# EAGLE design SecUSB (EAGLE 7.1.0)
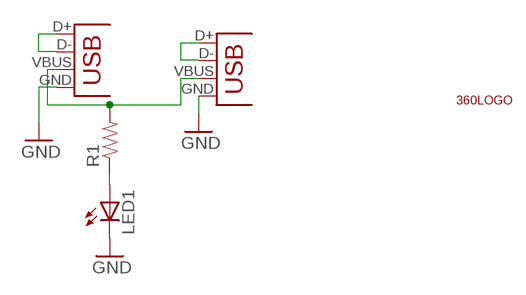
[diagram p0: schematic, sheet 1]

## Parts
LED1  LED0603  [LED-0603]
R1  RESISTOR0603-RES  [0603-RES]
U$1  360LOGO_0.8  [360LOGO_0.8]
X2  USB_4-A-H_2  [USB-A-H_2]
X3  USB_4_3  [USB-A-3]

## Nets
GND: LED1.C X2.GND X3.GND
N$1: R1.2 X2.VBUS X3.VBUS
N$2: X2.D+ X2.D-
N$3: X3.D+ X3.D-
N$4: LED1.A R1.1

## Library data of the parts
LED1 = 2SparkFun:LED: LEDs Standard schematic elements and footprints for 5mm, 3mm, 1206, and 0603 sized LEDs. 5mm - Spark Fun Electronics SKU : COM-00529 (and others)
R1 = 2SparkFun:RESISTOR: Resistor Basic schematic elements and footprints for 0603, 1206, and PTH resistors.
U$1 = 2SparkFun:360LOGO
X2 X3 = 2SparkFun:USB_4: USB Connectors USB-B-PTH is fully proven SKU : PRT-00139 USB-miniB is fully proven SKU : PRT-00587 USB-A-PCB is untested. USB-A-H is throughly reviewed, but untested. Spark Fun Electronics SKU : PRT-00437 USB-B-SMT is throughly reviewed, but untested. Needs silkscreen touching up. USB-A-S has not been used/tested USB-MB-H has not been used/tested

## Board
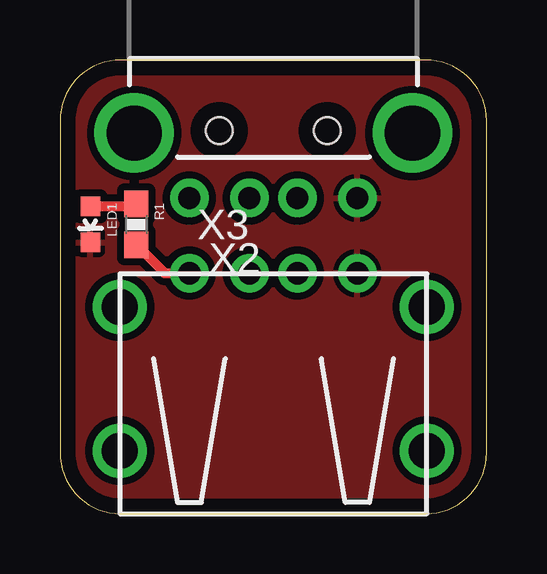
[diagram p1: board, top side]
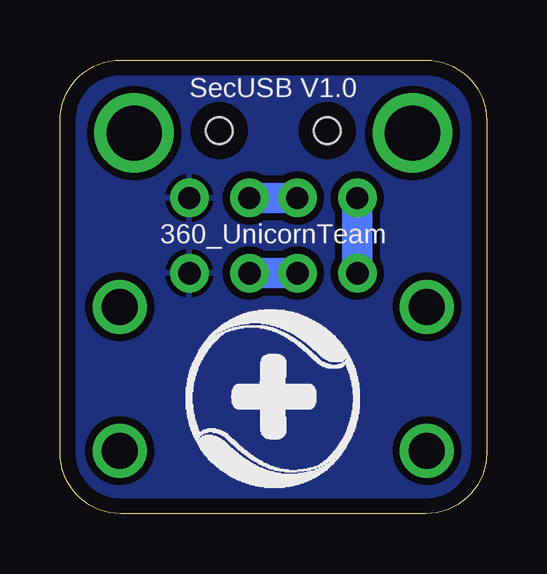
[diagram p2: board, bottom side, seen from below]

Size 17.78 x 18.92 mm. Coordinates in mm from the lower left corner, seen from the top.
Outline: 0,16.38 0,2.54 arc90 2.54,0 15.24,0 arc90 17.78,2.54 17.78,16.38 arc90 15.24,18.92 2.54,18.92 arc90 0,16.38
Copper layers (1*16): Top 0.035mm / dielectric 1.5mm / Bottom 0.035mm
Design rules "yun": minimum track width 8mil, minimum drill 15mil, track to track 8mil, track to pad 8mil, pad to pad 8mil, via to via 8mil, smd to smd 8mil, copper to edge 25mil, drill to drill 8mil, minimum pad ring 10mil, minimum via ring 8mil, stop-mask expansion 4mil, vias tented up to drill 20mil, thermal gap 8mil

### Footprints (pad centres in the part's own frame; a part is rotated, then mirrored left to right if it is on the bottom)
LED-0603 = smd 0.8 x 0.8: A 0,-0.75; C 0,0.75
0603-RES = smd 1.1 x 1: 1 -0.85,0; 2 0.85,0
USB-A-H_2 = drill 0.92 pad 1.6: D+ 2.71,1; D- 2.71,-1; VBUS 2.71,-3.5 | drill 0.914 pad 1.6: GND 2.71,3.5 | drill 2.3: GND2 0,-5.8; GND3 0,5.8 | hole 1.1: -0.1,2.25; -0.1,-2.25
USB-A-3 = drill 0.93 pad 1.6: D+ 1,4.315; D- -1,4.315; GND 3.5,4.315; VBUS -3.5,4.315 | drill 1.5: GND@1 6.4,2.915; GND@2 -6.4,2.915; GND@3 6.4,-3.085; GND@4 -6.4,-3.085

### Placement (x,y rotation side)
LED1  1.27,12.06 180 top
R1  3.18,12.06 270 top
U$1  8.89,4.83 0 bottom
X2  8.89,15.88 270 top
X3  8.89,5.71 0 top

### Tracks (layer width: path | path; a pad name or v marks a point on that pad's centre or on a via)
GND
  pour Bottom (isolate 0.305, rank 2): 0,18.92 0,0 17.78,0 17.78,18.92
  pour Top (isolate 0.305, rank 2): 17.78,18.92 0,18.92 0,0 17.78,0
N$1
  Top 0.406: R1.2 4.36,10.03 X3.VBUS
  Bottom 1.27: X2.VBUS X3.VBUS
N$2
  Bottom 1.27: X2.D- X2.D+
N$3
  Bottom 1.27: X3.D+ X3.D-
N$4
  Top 0.406: R1.1 3.08,12.81 LED1.A

### Text on the board
bPlace: SecUSB V1.0 | 360_UnicornTeam